# EAGLE design ArduinoBasic (EAGLE 9.6.2)
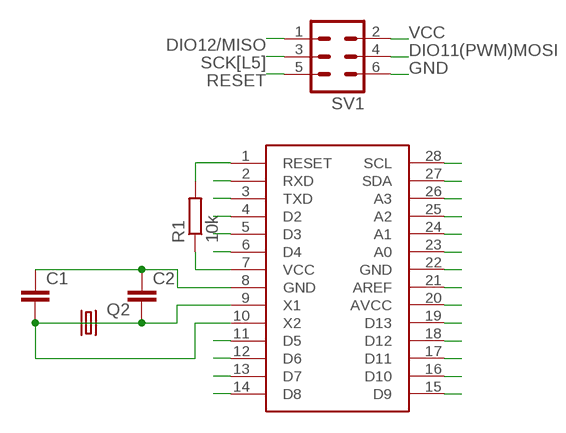
[diagram p0: schematic, sheet 1]

## Parts
C1  C-EU025-024X044  [C025-024X044]
C2  C-EU025-024X044  [C025-024X044]
Q2  CRYSTALHC49S  [HC49/S]
R1  10k  R-EU_0207/15  [0207/15]
SV1  MA03-2  [MA03-2]
U$1  ATMEGA328P-PU  [DIL28-3]

## Nets
A0: U$1.23(A0)
A1: U$1.24(A1)
A2: U$1.25(A2)
A3: U$1.26(A3)
A4[SDA]: U$1.27(SDA)
A5[SCL]: U$1.28(SCL)
AREF: U$1.21(AREF)
DIO1(TX): U$1.3(TXD)
DIO2: U$1.4(D2)
DIO3(PWM): U$1.5(D3)
DIO4: U$1.6(D4)
DIO5(PWM): U$1.11(D5)
DIO6(PWM): U$1.12(D6)
DIO7: U$1.13(D7)
DIO8: U$1.14(D8)
DIO9(PWM): U$1.15(D9)
DIO10(PWM): U$1.16(D10)
DIO11(PWM)MOSI: SV1.4 U$1.17(D11)
DIO12/MISO: SV1.1 U$1.18(D12)
DPIO0(RX): U$1.2(RXD)
GND: C1.1 C2.1 SV1.6 U$1.8(GND) U$1.22(GND)
RESET: R1.2 SV1.5 U$1.1(RESET)
SCK[L5]: SV1.3 U$1.19(D13)
VCC: R1.1 SV1.2 U$1.7(VCC) U$1.20(AVCC)
X1: C2.2 Q2.1 U$1.9(X1)
X2: C1.2 Q2.2 U$1.10(X2)

## Library data of the parts
C1 C2 = rcl:C-EU: CAPACITOR, European symbol
Q2 = crystal:CRYSTAL: CRYSTAL; OC_FARNELL: 1667008; OC_NEWARK: unknown
R1 = rcl:R-EU_: RESISTOR, European symbol
SV1 = con-lstb:MA03-2: PIN HEADER; OC_FARNELL: unknown; OC_NEWARK: unknown
U$1 = atmel2:ATMEGA328P-PU

## Board
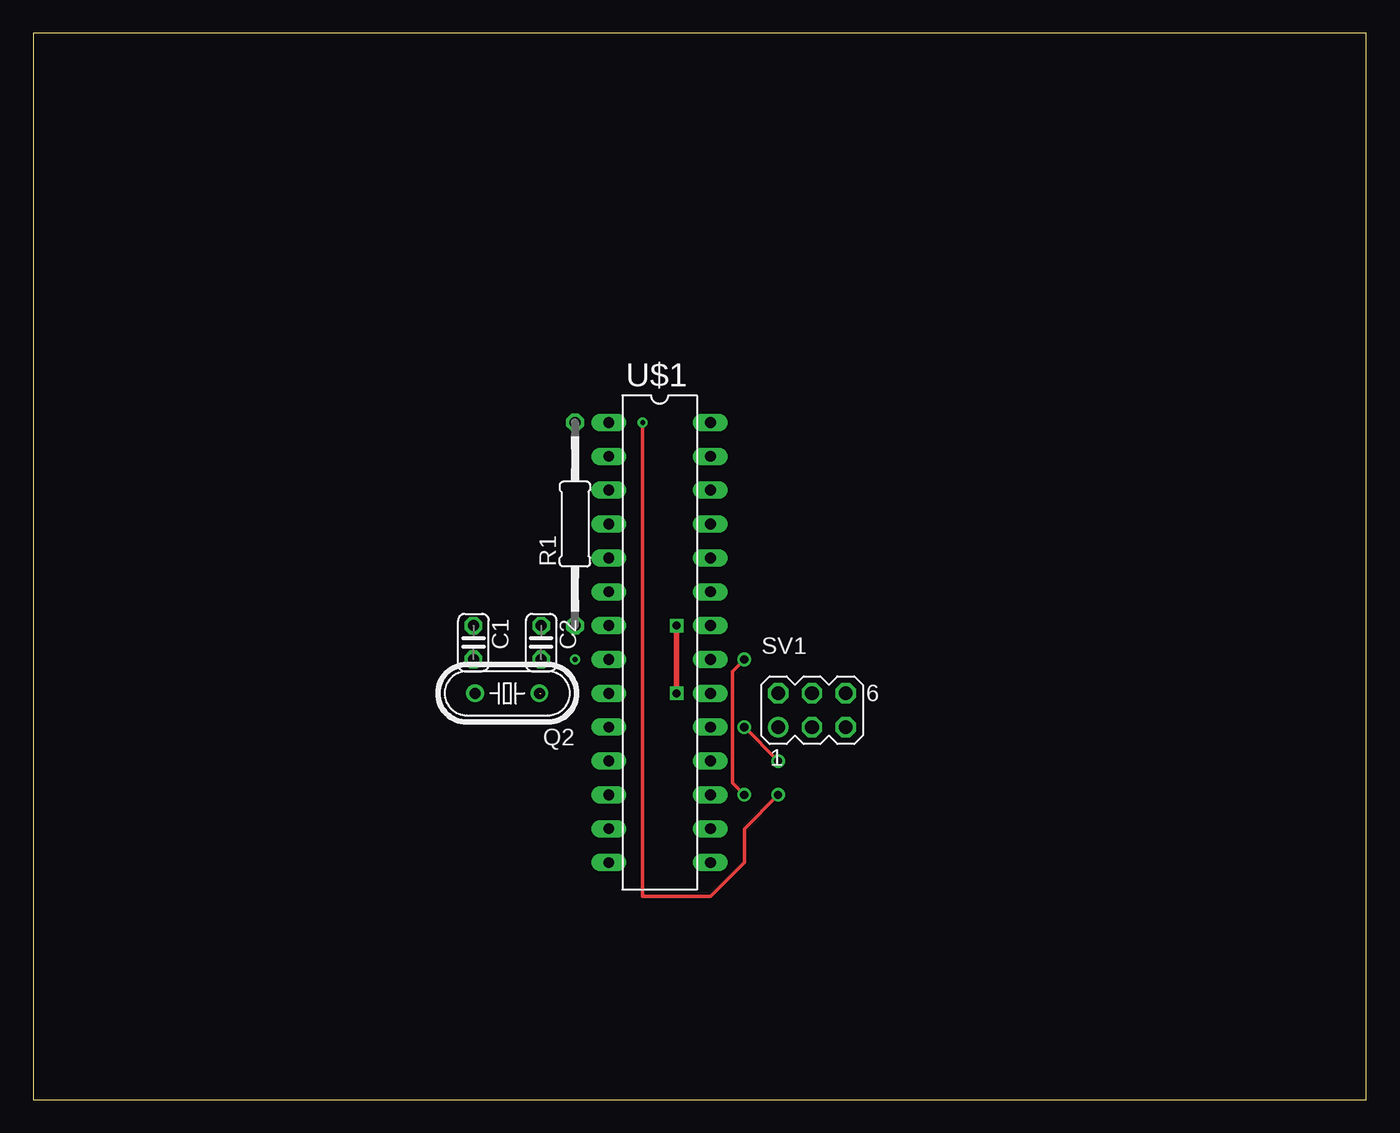
[diagram p1: board, top side]
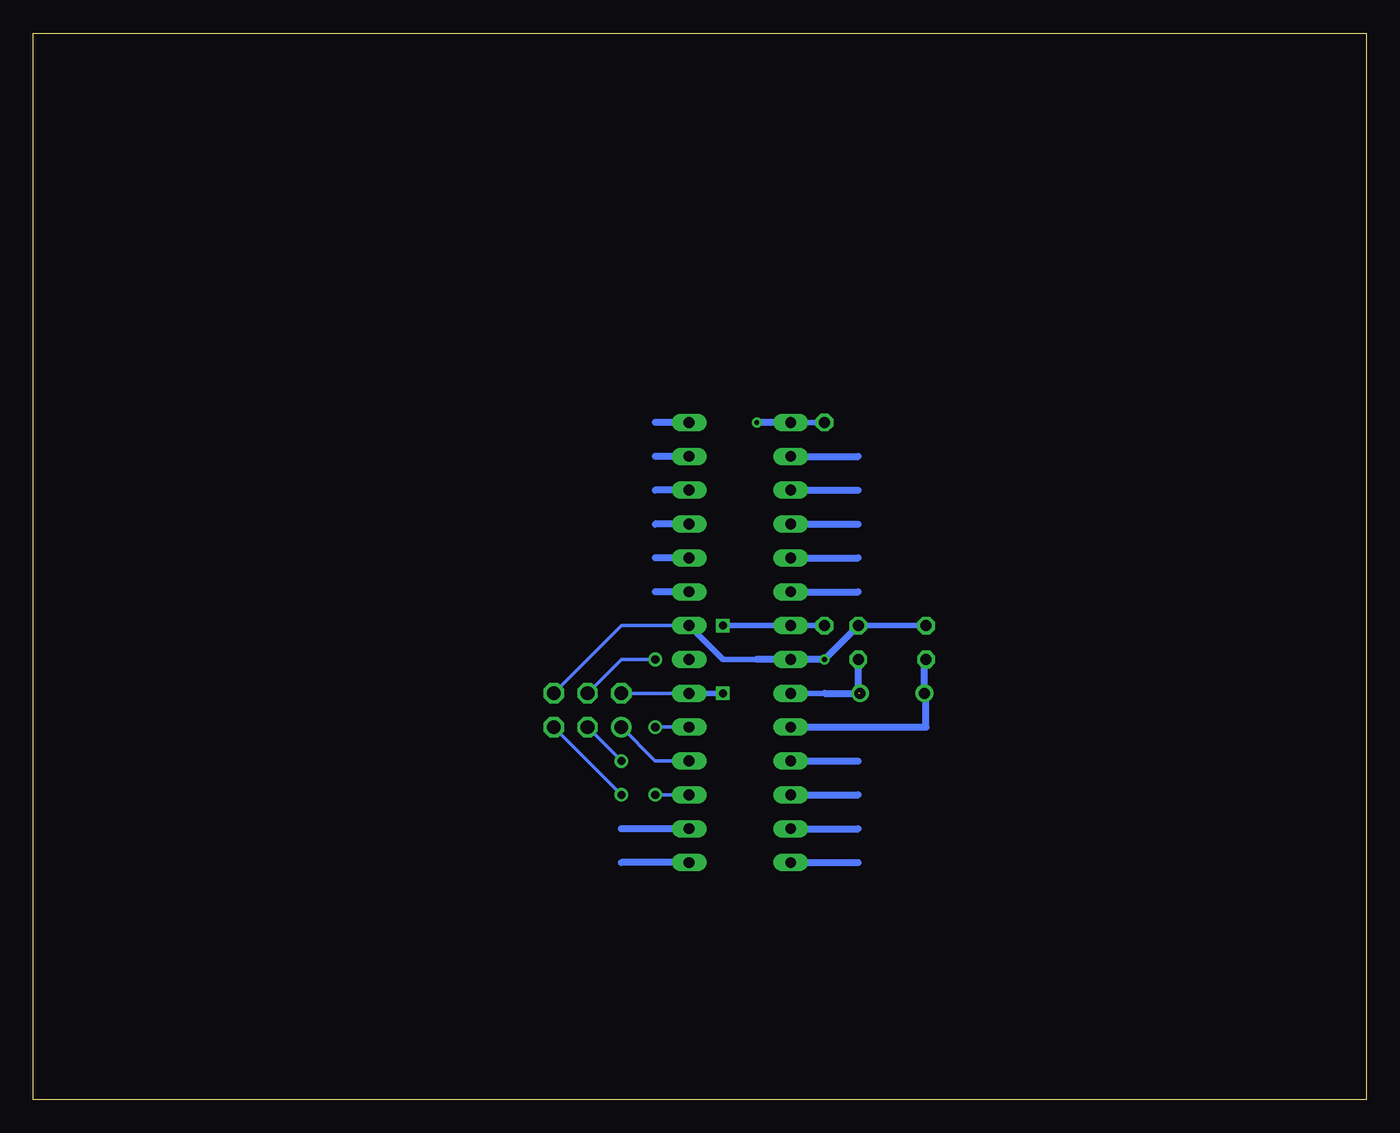
[diagram p2: board, bottom side, seen from below]

Size 100 x 80 mm. Coordinates in mm from the lower left corner, seen from the top.
Outline: 0,0 100,0 100,80 0,80 0,0
Copper layers (1*16): Top 0.035mm / dielectric 1.5mm / Bottom 0.035mm
Design rules "default": minimum track width 10mil, minimum drill 24mil, track to track 8mil, track to pad 8mil, pad to pad 8mil, via to via 8mil, smd to smd 8mil, copper to edge 40mil, drill to drill 8mil, minimum pad ring 10mil, minimum via ring 8mil, stop-mask expansion 4mil, vias tented up to drill 0mil, thermal gap 10mil

### Footprints (pad centres in the part's own frame; a part is rotated, then mirrored left to right if it is on the bottom)
C025-024X044 = drill 0.813 octagon: 1 -1.27,0; 2 1.27,0
HC49/S = drill 0.813: 1 -2.413,0; 2 2.413,0
0207/15 = drill 0.813 octagon: 1 -7.62,0; 2 7.62,0
MA03-2 = drill 1.016: 1 -2.54,-1.27 | drill 1.016 octagon: 2 -2.54,1.27; 3 0,-1.27; 4 0,1.27; 5 2.54,-1.27; 6 2.54,1.27
DIL28-3 = drill 0.813 long: 1 -16.51,-3.81; 2 -13.97,-3.81; 3 -11.43,-3.81; 4 -8.89,-3.81; 5 -6.35,-3.81; 6 -3.81,-3.81; 7 -1.27,-3.81; 8 1.27,-3.81; 9 3.81,-3.81; 10 6.35,-3.81; 11 8.89,-3.81; 12 11.43,-3.81; 13 13.97,-3.81; 14 16.51,-3.81; 15 16.51,3.81; 16 13.97,3.81; 17 11.43,3.81; 18 8.89,3.81; 19 6.35,3.81; 20 3.81,3.81; 21 1.27,3.81; 22 -1.27,3.81; 23 -3.81,3.81; 24 -6.35,3.81; 25 -8.89,3.81; 26 -11.43,3.81; 27 -13.97,3.81; 28 -16.51,3.81

### Placement (x,y rotation side)
C1  33.02,34.29 270 top
C2  38.1,34.29 270 top
Q2  35.56,30.48 180 top
R1  40.64,43.18 90 top
SV1  58.42,29.21 0 top
U$1  46.99,34.29 270 top

### Tracks (layer width: path | path; a pad name or v marks a point on that pad's centre or on a via)
A0
  Bottom 0.508: U$1.23 53.34,38.1
A1
  Bottom 0.508: U$1.24 53.34,40.64
A2
  Bottom 0.508: U$1.25 53.34,43.18
A3
  Bottom 0.508: U$1.26 53.34,45.72
A4[SDA]
  Bottom 0.508: U$1.27 53.34,48.26
A5[SCL]
  Bottom 0.508: U$1.28 53.34,50.8
DIO1(TX)
  Bottom 0.508: U$1.3 38.1,45.72
DIO2
  Bottom 0.508: U$1.4 38.1,43.18
DIO3(PWM)
  Bottom 0.508: U$1.5 38.1,40.64
DIO4
  Bottom 0.508: U$1.6 38.1,38.1
DIO5(PWM)
  Bottom 0.508: U$1.11 38.1,25.4
DIO6(PWM)
  Bottom 0.508: U$1.12 38.1,22.86
DIO7
  Bottom 0.508: U$1.13 38.1,20.32
DIO8
  Bottom 0.508: U$1.14 38.1,17.78
DIO9(PWM)
  Bottom 0.508: U$1.15 55.88,17.78
DIO10(PWM)
  Bottom 0.508: U$1.16 55.88,20.32
DIO11(PWM)MOSI  (via drill 0.61)
  Top 0.254: v53.34,33.02 52.45,32.13 52.45,31.75 | v53.34,22.86 52.45,23.75
  Bottom 0.254: SV1.4 55.88,33.02 v53.34,33.02 | v53.34,22.86 U$1.17
DIO12/MISO
  Bottom 0.254: SV1.1 53.34,25.4 U$1.18
DPIO0(RX)
  Bottom 0.508: U$1.2 38.1,48.26
GND  (via drill 0.35)
  Bottom 0.254: SV1.6 55.88,35.56 U$1.22
  Bottom 0.406: C2.1 C1.1 | 45.72,33.02 48.26,33.02 U$1.22
  Bottom 0.508: 45.72,33.02 U$1.8 v40.64,33.02 C2.1
N$1
  Top 0.254: 52.45,32 52.45,23.75
RESET  (via drill 0.35, 0.61)
  Top 0.254: v55.88,22.86 53.34,20.32 53.34,17.78 50.8,15.24 45.72,15.24 v45.72,50.8
  Bottom 0.254: SV1.5 v55.88,22.86
  Bottom 0.406: U$1.1 R1.2
  Bottom 0.508: U$1.1 v45.72,50.8
SCK[L5]  (via drill 0.61)
  Top 0.254: v53.34,27.94 v55.88,25.4
  Bottom 0.254: v55.88,25.4 SV1.3 | U$1.19 v53.34,27.94
VCC  (via drill 0.6)
  Top 0.406: v48.26,35.56 v48.26,30.48
  Bottom 0.254: U$1.20 SV1.2
  Bottom 0.406: v48.26,35.56 U$1.7 R1.1 | v48.26,30.48 U$1.20
X1  (1 unrouted)
  Bottom 0.406: U$1.9 40.64,30.48
  Bottom 0.508: 40.64,30.48 38.1,30.48 | Q2.1 38.1,30.61 C2.2
X2
  Bottom 0.508: U$1.10 33.02,27.94 33.02,30.35 Q2.2 33.15,32.89 C1.2

### Text on the board
Document: A5[SCL] | DPIO0(RX) | A4[SDA] | DIO1(TX) | A3 | DIO2 | A2 | DIO3(PWM) | A1 | DIO4 | A0 | AREF | SCK | DIO5(PWM) | DIO12/MISO | DIO6(PWM) | DIO11(PWM)MOSI | DIO7 | DIO10(PWM) | DIO8 | DIO9(PWM)